# EAGLE schematic Arduhub_plane (EAGLE 7.3.0)

## Sheet 1 of 3: HUB
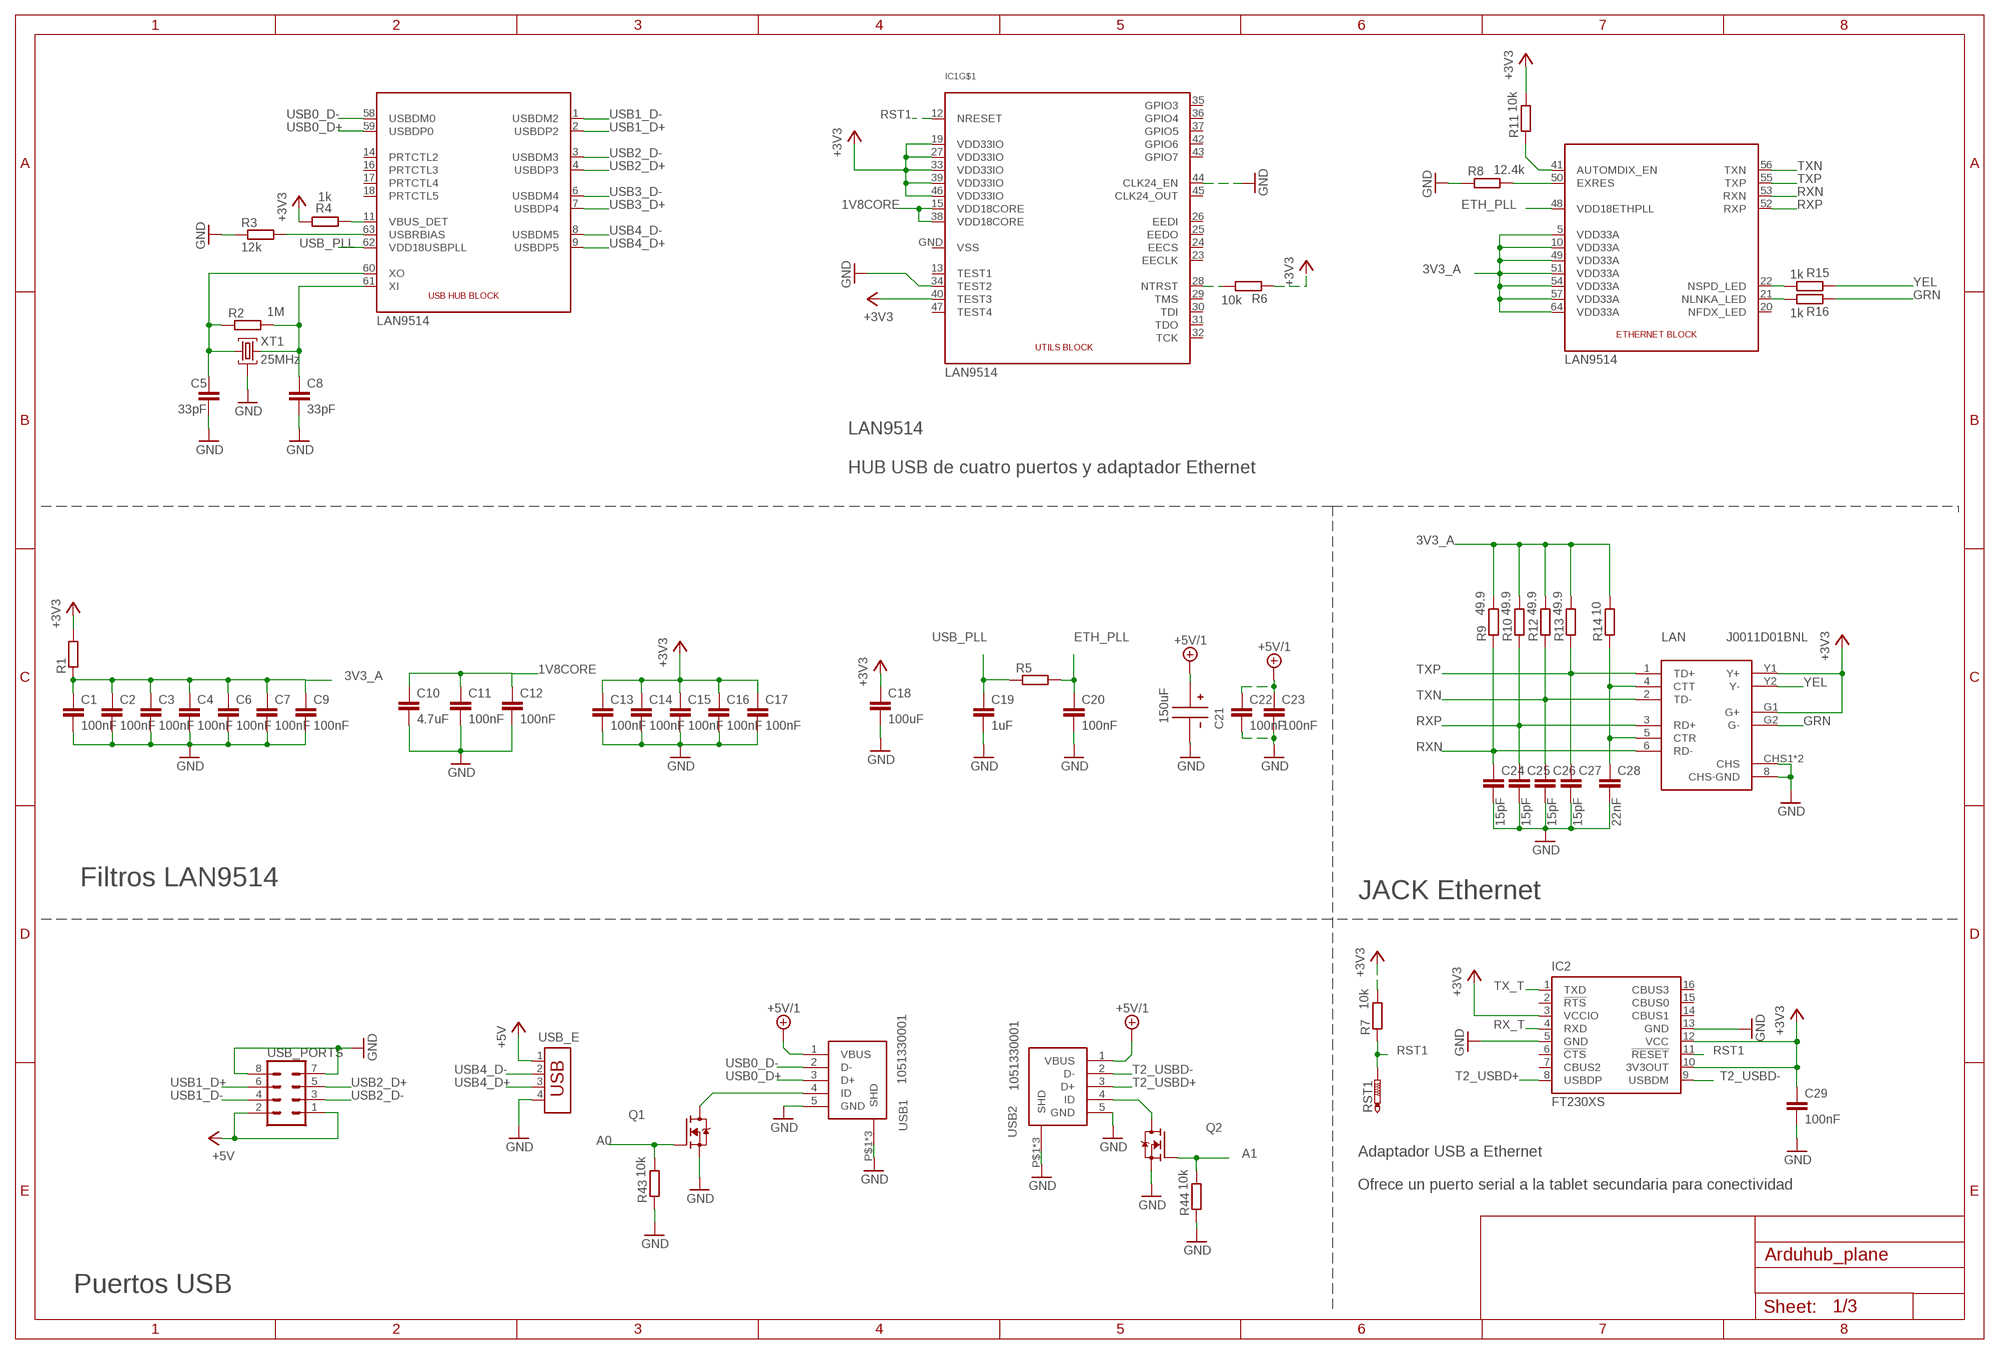
[diagram p0: schematic, sheet 1]

### Parts
C1  100nF  C-EUC0402  [C0402]
C2  100nF  C-EUC0402  [C0402]
C3  100nF  C-EUC0402  [C0402]
C4  100nF  C-EUC0402  [C0402]
C5  33pF  C-EUC0402  [C0402]
C6  100nF  C-EUC0402  [C0402]
C7  100nF  C-EUC0402  [C0402]
C8  33pF  C-EUC0402  [C0402]
C9  100nF  C-EUC0402  [C0402]
C10  4.7uF  C-EUC0402  [C0402]
C11  100nF  C-EUC0402  [C0402]
C12  100nF  C-EUC0402  [C0402]
C13  100nF  C-EUC0402  [C0402]
C14  100nF  C-EUC0402  [C0402]
C15  100nF  C-EUC0402  [C0402]
C16  100nF  C-EUC0402  [C0402]
C17  100nF  C-EUC0402  [C0402]
C18  100uF  C-EUC0603  [C0603]
C19  1uF  C-EUC0402  [C0402]
C20  100nF  C-EUC0402  [C0402]
C21  150uF  EMVE100ADA151MF55G  [MVA_CAP_F55]
C22  100nF  C-EUC0402  [C0402]
C23  100nF  C-EUC0402  [C0402]
C24  15pF  C-EUC0402  [C0402]
C25  15pF  C-EUC0402  [C0402]
C26  15pF  C-EUC0402  [C0402]
C27  15pF  C-EUC0402  [C0402]
C28  22nF  C-EUC0402  [C0402]
C29  100nF  C-EUC0402  [C0402]
IC1  LAN9514  [QFN64]
IC2  FT230XS  [SSOP16]
LAN  J0011D01BNL  [J0011D01BNL]
Q1  TRANSISTOR_FET_BS170-SOT-23  [SOT-23]
Q2  TRANSISTOR_FET_BS170-SOT-23  [SOT-23]
R1  R-EU_R0603  [R0603]
R2  1M  R-EU_R0402  [R0402]
R3  12k  R-EU_R0402  [R0402]
R4  1k  R-EU_R0402  [R0402]
R5  R-EU_R0603  [R0603]
R6  10k  R-EU_R0402  [R0402]
R7  10k  R-EU_R0402  [R0402]
R8  12.4k  R-EU_R0402  [R0402]
R9  49.9  R-EU_R0402  [R0402]
R10  49.9  R-EU_R0402  [R0402]
R11  10k  R-EU_R0402  [R0402]
R12  49.9  R-EU_R0402  [R0402]
R13  49.9  R-EU_R0402  [R0402]
R14  10  R-EU_R0402  [R0402]
R15  1k  R-EU_R0402  [R0402]
R16  1k  R-EU_R0402  [R0402]
R43  10k  R-EU_R0402  [R0402]
R44  10k  R-EU_R0402  [R0402]
RST1  PTR1B1,27  [B1,27]
USB1  1051330001  [1051330001]
USB2  1051330001  [1051330001]
USB_E  USB-787616  [USB]
USB_PORTS  MA04-2  [MA04-2]
XT1  25MHz  ABM8G  [ABM8G]

### Nets
1V8CORE: C10.1 C11.1 C12.1 IC1.15(VDD18CORE) IC1.38(VDD18CORE)
3V3_A: C1.1 C2.1 C3.1 C4.1 C6.1 C7.1 C9.1 IC1.5(VDD33A) IC1.10(VDD33A) IC1.49(VDD33A) IC1.51(VDD33A) IC1.54(VDD33A) IC1.57(VDD33A) IC1.64(VDD33A) R1.1 R9.2 R10.2 R12.2 R13.2 R14.2
+3V3: C13.1 C14.1 C15.1 C16.1 C17.1 C18.1 C29.1 IC1.19(VDD33IO) IC1.27(VDD33IO) IC1.33(VDD33IO) IC1.39(VDD33IO) IC1.40(TEST3) IC1.46(VDD33IO) IC2.3(VCCIO) IC2.10(3V3OUT) IC2.12(VCC) LAN.G1(G+) LAN.Y1(Y+) R1.2 R4.2 R6.1 R7.2 R11.2 ; also sheet 2
+5V: USB_E.1 USB_PORTS.1 USB_PORTS.2 ; also sheet 2
+5V/1: C21.P$+ C22.1 C23.1 USB1.1(VBUS) USB2.1(VBUS) ; also sheet 2
A0: Q1.1(G) R43.2 ; also sheet 2
A1: Q2.1(G) R44.2 ; also sheet 2
ETH_PLL: C20.1 IC1.48(VDD18ETHPLL) R5.2
GND: C1.2 C2.2 C3.2 C4.2 C5.2 C6.2 C7.2 C8.2 C9.2 C10.2 C11.2 C12.2 C13.2 C14.2 C15.2 C16.2 C17.2 C18.2 C19.2 C20.2 C21.P$- C22.2 C23.2 C24.2 C25.2 C26.2 C27.2 C28.2 C29.2 IC1.34(TEST2) IC1.44(CLK24_EN) IC2.5(GND) IC2.13(GND) LAN.8(CHS-GND) LAN.CHS1(CHS) LAN.CHS2(CHS) Q1.2(S) Q2.2(S) R3.1 R8.1 R43.1 R44.1 USB1.5(GND) USB1.P$1(SHD) USB1.P$2(SHD) USB1.P$3(SHD) USB2.5(GND) USB2.P$1(SHD) USB2.P$2(SHD) USB2.P$3(SHD) USB_E.4 USB_PORTS.7 USB_PORTS.8 XT1.2 XT1.4 ; also sheet 2
GRN: LAN.G2(G-) R16.1
N$1: C5.1 IC1.60(XO) R2.1 XT1.1
N$2: C8.1 IC1.61(XI) R2.2 XT1.3
N$3: IC1.50(EXRES) R8.2
N$4: IC1.63(USBRBIAS) R3.2
N$5: C28.1 LAN.4(CTT) LAN.5(CTR) R14.1
N$6: IC1.41(AUTOMDIX_EN) R11.1
N$7: IC1.21(NLNKA_LED) R16.2
N$8: IC1.22(NSPD_LED) R15.2
N$9: Q1.3(D) USB1.4(ID)
N$10: IC1.28(NTRST) R6.2
N$21: Q2.3(D) USB2.4(ID)
N$33: IC1.11(VBUS_DET) R4.1
RST1: IC1.12(NRESET) IC2.11(!RESET) R7.1 RST1.TP ; also sheet 2
RX_T: IC2.4(RXD) ; also sheet 2
RXN: C24.1 IC1.53(RXN) LAN.6(RD-) R9.1
RXP: C25.1 IC1.52(RXP) LAN.3(RD+) R10.1
T2_USBD+: IC2.8(USBDP) USB2.3(D+)
T2_USBD-: IC2.9(USBDM) USB2.2(D-)
TX_T: IC2.1(TXD) ; also sheet 2
TXN: C26.1 IC1.56(TXN) LAN.2(TD-) R12.1
TXP: C27.1 IC1.55(TXP) LAN.1(TD+) R13.1
USB0_D+: IC1.59(USBDP0) USB1.3(D+)
USB0_D-: IC1.58(USBDM0) USB1.2(D-)
USB1_D+: IC1.2(USBDP2) USB_PORTS.6
USB1_D-: IC1.1(USBDM2) USB_PORTS.4
USB2_D+: IC1.4(USBDP3) USB_PORTS.5
USB2_D-: IC1.3(USBDM3) USB_PORTS.3
USB3_D+: IC1.7(USBDP4) ; also sheet 2
USB3_D-: IC1.6(USBDM4) ; also sheet 2
USB4_D+: IC1.9(USBDP5) USB_E.3
USB4_D-: IC1.8(USBDM5) USB_E.2
USB_PLL: C19.1 IC1.62(VDD18USBPLL) R5.1
YEL: LAN.Y2(Y-) R15.1
Unconnected: IC1.13(TEST1) IC1.14(PRTCTL2) IC1.16(PRTCTL3) IC1.17(PRTCTL4) IC1.18(PRTCTL5) IC1.20(NFDX_LED) IC1.23(EECLK) IC1.24(EECS) IC1.25(EEDO) IC1.26(EEDI) IC1.29(TMS) IC1.30(TDI) IC1.31(TDO) IC1.32(TCK) IC1.35(GPIO3) IC1.36(GPIO4) IC1.37(GPIO5) IC1.42(GPIO6) IC1.43(GPIO7) IC1.45(CLK24_OUT) IC1.47(TEST4) IC1.GND(VSS) IC2.2(!RTS) IC2.6(!CTS) IC2.7(CBUS2) IC2.14(CBUS1) IC2.15(CBUS0) IC2.16(CBUS3)

### Notes on the sheet
- LAN9514
  
  HUB USB de cuatro puertos y adaptador Ethernet
- Filtros LAN9514
- JACK Ethernet
- Adaptador USB a Ethernet
  
  Ofrece un puerto serial a la tablet secundaria para conectividad
- Puertos USB

## Sheet 2 of 3: UART, uC, Energía
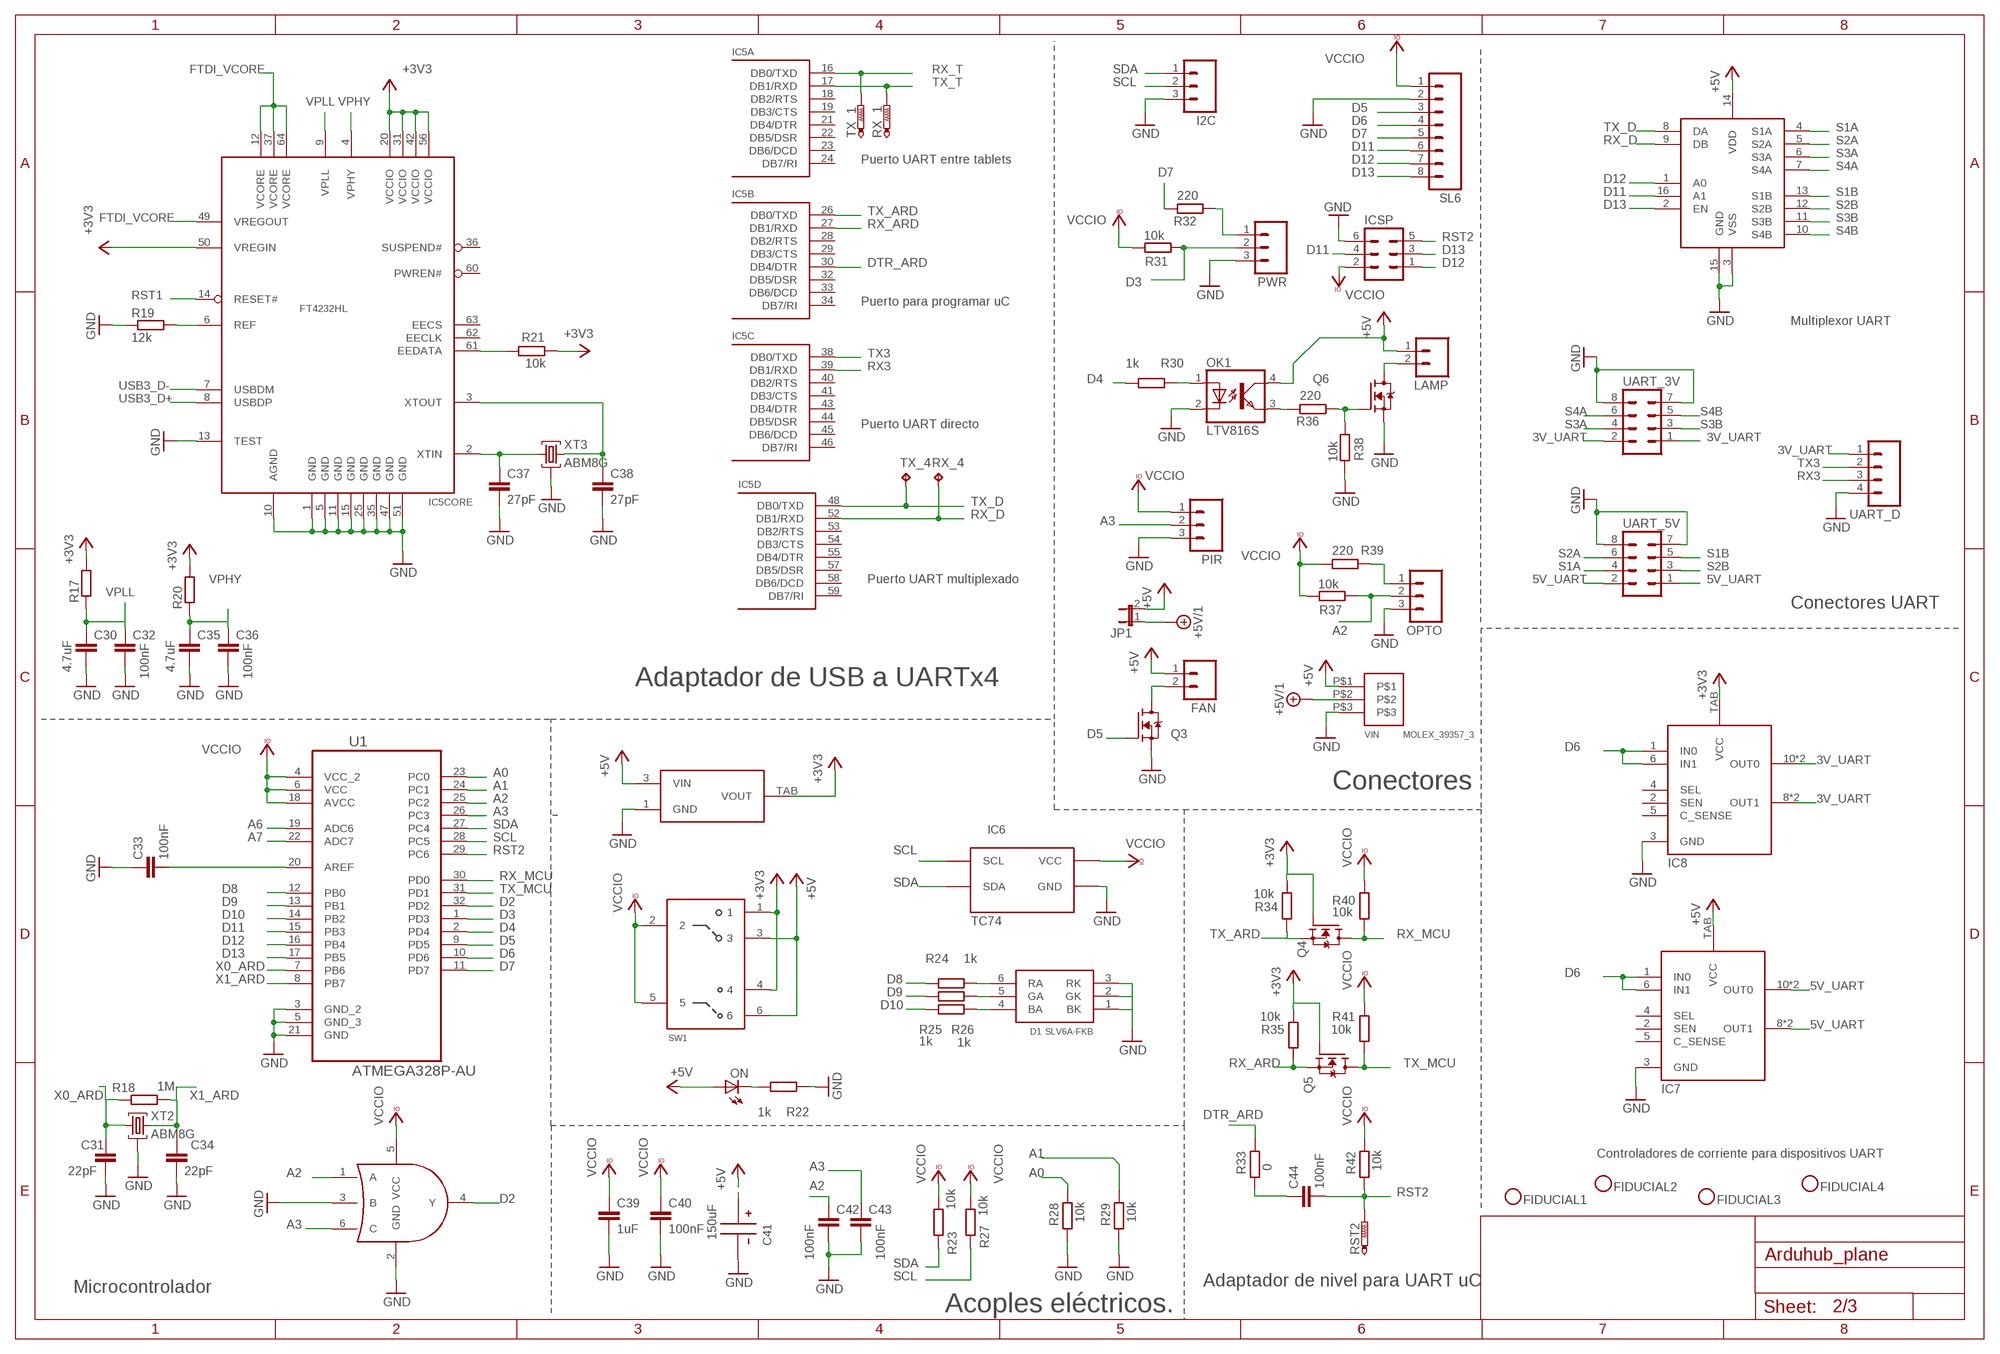
[diagram p1: schematic, sheet 2]

### Parts
C30  4.7uF  C-EUC0402  [C0402]
C31  22pF  C-EUC0402  [C0402]
C32  100nF  C-EUC0402  [C0402]
C33  100nF  C-EUC0402  [C0402]
C34  22pF  C-EUC0402  [C0402]
C35  4.7uF  C-EUC0402  [C0402]
C36  100nF  C-EUC0402  [C0402]
C37  27pF  C-EUC0402  [C0402]
C38  27pF  C-EUC0402  [C0402]
C39  1uF  C-EUC0402  [C0402]
C40  100nF  C-EUC0402  [C0402]
C41  150uF  EMVE100ADA151MF55G  [MVA_CAP_F55]
C42  100nF  C-EUC0402  [C0402]
C43  100nF  C-EUC0402  [C0402]
C44  100nF  C-EUC0402  [C0402]
D1  SLV6A-FKB  [PLCC-6]
FAN  M02  [02P]
FIDUCIAL1  FIDU_2C  [FIDUCIAL_TEST_2C]
FIDUCIAL2  FIDU_2C  [FIDUCIAL_TEST_2C]
FIDUCIAL3  FIDU_2C  [FIDUCIAL_TEST_2C]
FIDUCIAL4  FIDU_2C  [FIDUCIAL_TEST_2C]
I2C  M03  [03P]
IC3  SN74LVC1G332DBVR  [SOT-23-6]
IC4  AP1084D  [TO_252_3]
IC5  FT4232HL  [LQFP64]
IC6  TC74  [SOT-23-5]
IC7  VND7140AJ12TR  [POWERSSO-12]
IC8  VND7140AJ12TR  [POWERSSO-12]
IC9  MUX509IPWR  [TSSOP-16]
ICSP  MA03-2  [MA03-2]
JP1  JP1E  [JP1]
LAMP  M02  [02P]
OK1  LTV816S  [SMD4]
ON  LED-0603  [LED-603]
OPTO  M03  [03P]
PIR  M03  [03P]
PWR  M03  [03P]
Q3  TRANSISTOR_FET_BS170-SOT-23  [SOT-23]
Q4  TRANSISTOR_FET_BS170-SOT-23  [SOT-23]
Q5  TRANSISTOR_FET_BS170-SOT-23  [SOT-23]
Q6  TRANSISTOR_FET_BS170-SOT-23  [SOT-23]
R17  R-EU_R0603  [R0603]
R18  1M  R-EU_R0402  [R0402]
R19  12k  R-EU_R0402  [R0402]
R20  R-EU_R0603  [R0603]
R21  10k  R-EU_R0402  [R0402]
R22  1k  R-EU_R0402  [R0402]
R23  10k  R-EU_R0402  [R0402]
R24  1k  R-EU_R0402  [R0402]
R25  1k  R-EU_R0402  [R0402]
R26  1k  R-EU_R0402  [R0402]
R27  10k  R-EU_R0402  [R0402]
R28  10k  R-EU_R0402  [R0402]
R29  10k  R-EU_R0402  [R0402]
R30  1k  R-EU_R0402  [R0402]
R31  10k  R-EU_R0402  [R0402]
R32  220  R-EU_R0402  [R0402]
R33  0  R-EU_R0402  [R0402]
R34  10k  R-EU_R0402  [R0402]
R35  10k  R-EU_R0402  [R0402]
R36  220  R-EU_R0402  [R0402]
R37  10k  R-EU_R0402  [R0402]
R38  10k  R-EU_R0402  [R0402]
R39  220  R-EU_R0402  [R0402]
R40  10k  R-EU_R0402  [R0402]
R41  10k  R-EU_R0402  [R0402]
R42  10k  R-EU_R0402  [R0402]
RST2  PTR1TP06SQ  [TP06SQ]
RX_1  PTR1TP06SQ  [TP06SQ]
RX_4  TPTP06SQ  [TP06SQ]
SL6  M08  [08P]
SW1  452403012014  [452403012014]
TX_1  PTR1TP06SQ  [TP06SQ]
TX_4  TPTP06SQ  [TP06SQ]
U1  ATMEGA328P-AU  [QFP80P900X900X120-32N]
UART_3V  MA04-2  [MA04-2]
UART_5V  MA04-2  [MA04-2]
UART_D  M04  [04P]
VIN  MOLEX_39357_3  [MOLEX_39357-3]
XT2  ABM8G  [ABM8G]
XT3  ABM8G  [ABM8G]

### Nets
3V_UART: IC8.8(OUT1) IC8.9(OUT1) IC8.10(OUT0) IC8.11(OUT0) UART_3V.1 UART_3V.2 UART_D.1
5V_UART: IC7.8(OUT1) IC7.9(OUT1) IC7.10(OUT0) IC7.11(OUT0) UART_5V.1 UART_5V.2
+3V3: IC4.TAB(VOUT) IC5.20(CORE:VCCIO) IC5.31(CORE:VCCIO) IC5.42(CORE:VCCIO) IC5.50(CORE:VREGIN) IC5.56(CORE:VCCIO) IC8.TAB(VCC) Q4.1(G) Q5.1(G) R17.2 R20.2 R21.1 R34.1 R35.1 SW1.1 SW1.4 ; also sheet 1
+5V: C41.P$+ FAN.1 IC4.3(VIN) IC7.TAB(VCC) IC9.14(VDD) JP1.2 LAMP.1 OK1.4(COL) ON.A SW1.3 SW1.6 VIN.P$1 ; also sheet 1
+5V/1: JP1.1 VIN.P$2 ; also sheet 1
A0: R28.1 U1.23(PC0) ; also sheet 1
A1: R29.1 U1.24(PC1) ; also sheet 1
A2: C42.1 IC3.1(A) OPTO.2 R37.2 U1.25(PC2)
A3: C43.1 IC3.6(C) PIR.2 U1.26(PC3)
A6: U1.19(ADC6)
A7: U1.22(ADC7)
D2: IC3.4(Y) U1.32(PD2)
D3: PWR.2 R31.2 U1.1(PD3)
D4: R30.2 U1.2(PD4)
D5: Q3.1(G) SL6.3 U1.9(PD5)
D6: IC7.1(IN0) IC7.6(IN1) IC8.1(IN0) IC8.6(IN1) SL6.4 U1.10(PD6)
D7: R32.2 SL6.5 U1.11(PD7)
D8: R24.1 U1.12(PB0)
D9: R25.1 U1.13(PB1)
D10: R26.1 U1.14(PB2)
D11: IC9.16(A1) ICSP.4 SL6.6 U1.15(PB3)
D12: IC9.1(A0) ICSP.1 SL6.7 U1.16(PB4)
D13: IC9.2(EN) ICSP.3 SL6.8 U1.17(PB5)
DTR_ARD: IC5.30(B:DB4/DTR) R33.1
FTDI_VCORE: IC5.12(CORE:VCORE) IC5.37(CORE:VCORE) IC5.49(CORE:VREGOUT) IC5.64(CORE:VCORE)
GND: C30.2 C31.2 C32.2 C33.1 C34.2 C35.2 C36.2 C37.2 C38.2 C39.2 C40.2 C41.P$- C42.2 C43.2 D1.1(BK) D1.2(GK) D1.3(RK) I2C.3 IC3.2(GND) IC3.3(B) IC4.1(GND) IC5.1(CORE:GND) IC5.5(CORE:GND) IC5.10(CORE:AGND) IC5.11(CORE:GND) IC5.13(CORE:TEST) IC5.15(CORE:GND) IC5.25(CORE:GND) IC5.35(CORE:GND) IC5.47(CORE:GND) IC5.51(CORE:GND) IC6.2(GND) IC7.3(GND) IC8.3(GND) IC9.3(VSS) IC9.15(GND) ICSP.6 OK1.2(C) OPTO.3 PIR.3 PWR.3 Q3.2(S) Q6.2(S) R19.1 R22.1 R28.2 R29.2 R38.1 SL6.2 U1.3(GND_2) U1.5(GND_3) U1.21(GND) UART_3V.7 UART_3V.8 UART_5V.7 UART_5V.8 UART_D.4 VIN.P$3 XT2.2 XT2.4 XT3.2 XT3.4 ; also sheet 1
N$11: IC5.61(CORE:EEDATA) R21.2
N$12: IC5.6(CORE:REF) R19.2
N$13: C37.1 IC5.2(CORE:XTIN) XT3.1
N$14: C38.1 IC5.3(CORE:XTOUT) XT3.3
N$17: C33.2 U1.20(AREF)
N$18: D1.6(RA) R24.2
N$19: D1.5(GA) R25.2
N$20: D1.4(BA) R26.2
N$23: ON.C R22.2
N$24: LAMP.2 Q6.3(D)
N$25: OPTO.1 R39.1
N$26: Q6.1(G) R36.1 R38.2
N$27: OK1.3(EMIT) R36.2
N$28: OK1.1(A) R30.1
N$29: FAN.2 Q3.3(D)
N$30: PWR.1 R32.1
N$32: C44.1 R33.2
RST1: IC5.14(CORE:RESET#) ; also sheet 1
RST2: C44.2 ICSP.5 R42.2 RST2.TP U1.29(PC6)
RX3: IC5.39(C:DB1/RXD) UART_D.3
RX_ARD: IC5.27(B:DB1/RXD) Q5.2(S) R35.2
RX_D: IC5.52(D:DB1/RXD) IC9.9(DB) RX_4.TP
RX_MCU: Q4.3(D) R40.2 U1.30(PD0)
RX_T: IC5.16(A:DB0/TXD) TX_1.TP ; also sheet 1
S1A: IC9.4(S1A) UART_5V.4
S1B: IC9.13(S1B) UART_5V.5
S2A: IC9.5(S2A) UART_5V.6
S2B: IC9.12(S2B) UART_5V.3
S3A: IC9.6(S3A) UART_3V.4
S3B: IC9.11(S3B) UART_3V.3
S4A: IC9.7(S4A) UART_3V.6
S4B: IC9.10(S4B) UART_3V.5
SCL: I2C.2 IC6.4(SCL) R27.2 U1.28(PC5)
SDA: I2C.1 IC6.5(SDA) R23.2 U1.27(PC4)
TX3: IC5.38(C:DB0/TXD) UART_D.2
TX_ARD: IC5.26(B:DB0/TXD) Q4.2(S) R34.2
TX_D: IC5.48(D:DB0/TXD) IC9.8(DA) TX_4.TP
TX_MCU: Q5.3(D) R41.2 U1.31(PD1)
TX_T: IC5.17(A:DB1/RXD) RX_1.TP ; also sheet 1
USB3_D+: IC5.8(CORE:USBDP) ; also sheet 1
USB3_D-: IC5.7(CORE:USBDM) ; also sheet 1
VCCIO: C39.1 C40.1 IC3.5(VCC) IC6.3(VCC) ICSP.2 PIR.1 R23.1 R27.1 R31.1 R37.1 R39.2 R40.1 R41.1 R42.1 SL6.1 SW1.2 SW1.5 U1.4(VCC_2) U1.6(VCC) U1.18(AVCC)
VPHY: C35.1 C36.1 IC5.4(CORE:VPHY) R20.1
VPLL: C30.1 C32.1 IC5.9(CORE:VPLL) R17.1
X0_ARD: C31.1 R18.1 U1.7(PB6) XT2.1
X1_ARD: C34.1 R18.2 U1.8(PB7) XT2.3
Unconnected: IC5.18(A:DB2/RTS) IC5.19(A:DB3/CTS) IC5.21(A:DB4/DTR) IC5.22(A:DB5/DSR) IC5.23(A:DB6/DCD) IC5.24(A:DB7/RI) IC5.28(B:DB2/RTS) IC5.29(B:DB3/CTS) IC5.32(B:DB5/DSR) IC5.33(B:DB6/DCD) IC5.34(B:DB7/RI) IC5.36(CORE:SUSPEND#) IC5.40(C:DB2/RTS) IC5.41(C:DB3/CTS) IC5.43(C:DB4/DTR) IC5.44(C:DB5/DSR) IC5.45(C:DB6/DCD) IC5.46(C:DB7/RI) IC5.53(D:DB2/RTS) IC5.54(D:DB3/CTS) IC5.55(D:DB4/DTR) IC5.57(D:DB5/DSR) IC5.58(D:DB6/DCD) IC5.59(D:DB7/RI) IC5.60(CORE:PWREN#) IC5.62(CORE:EECLK) IC5.63(CORE:EECS) IC7.2(SEN) IC7.4(SEL) IC7.5(C_SENSE) IC8.2(SEN) IC8.4(SEL) IC8.5(C_SENSE)

### Notes on the sheet
- Puerto UART entre tablets
- Puerto para programar uC
- Multiplexor UART
- Puerto UART directo
- Puerto UART multiplexado
- Conectores UART
- Adaptador de USB a UARTx4
- Conectores
- Controladores de corriente para dispositivos UART
- Adaptador de nivel para UART uC
- Microcontrolador
- Acoples eléctricos.

## Sheet 3 of 3: Adicionales
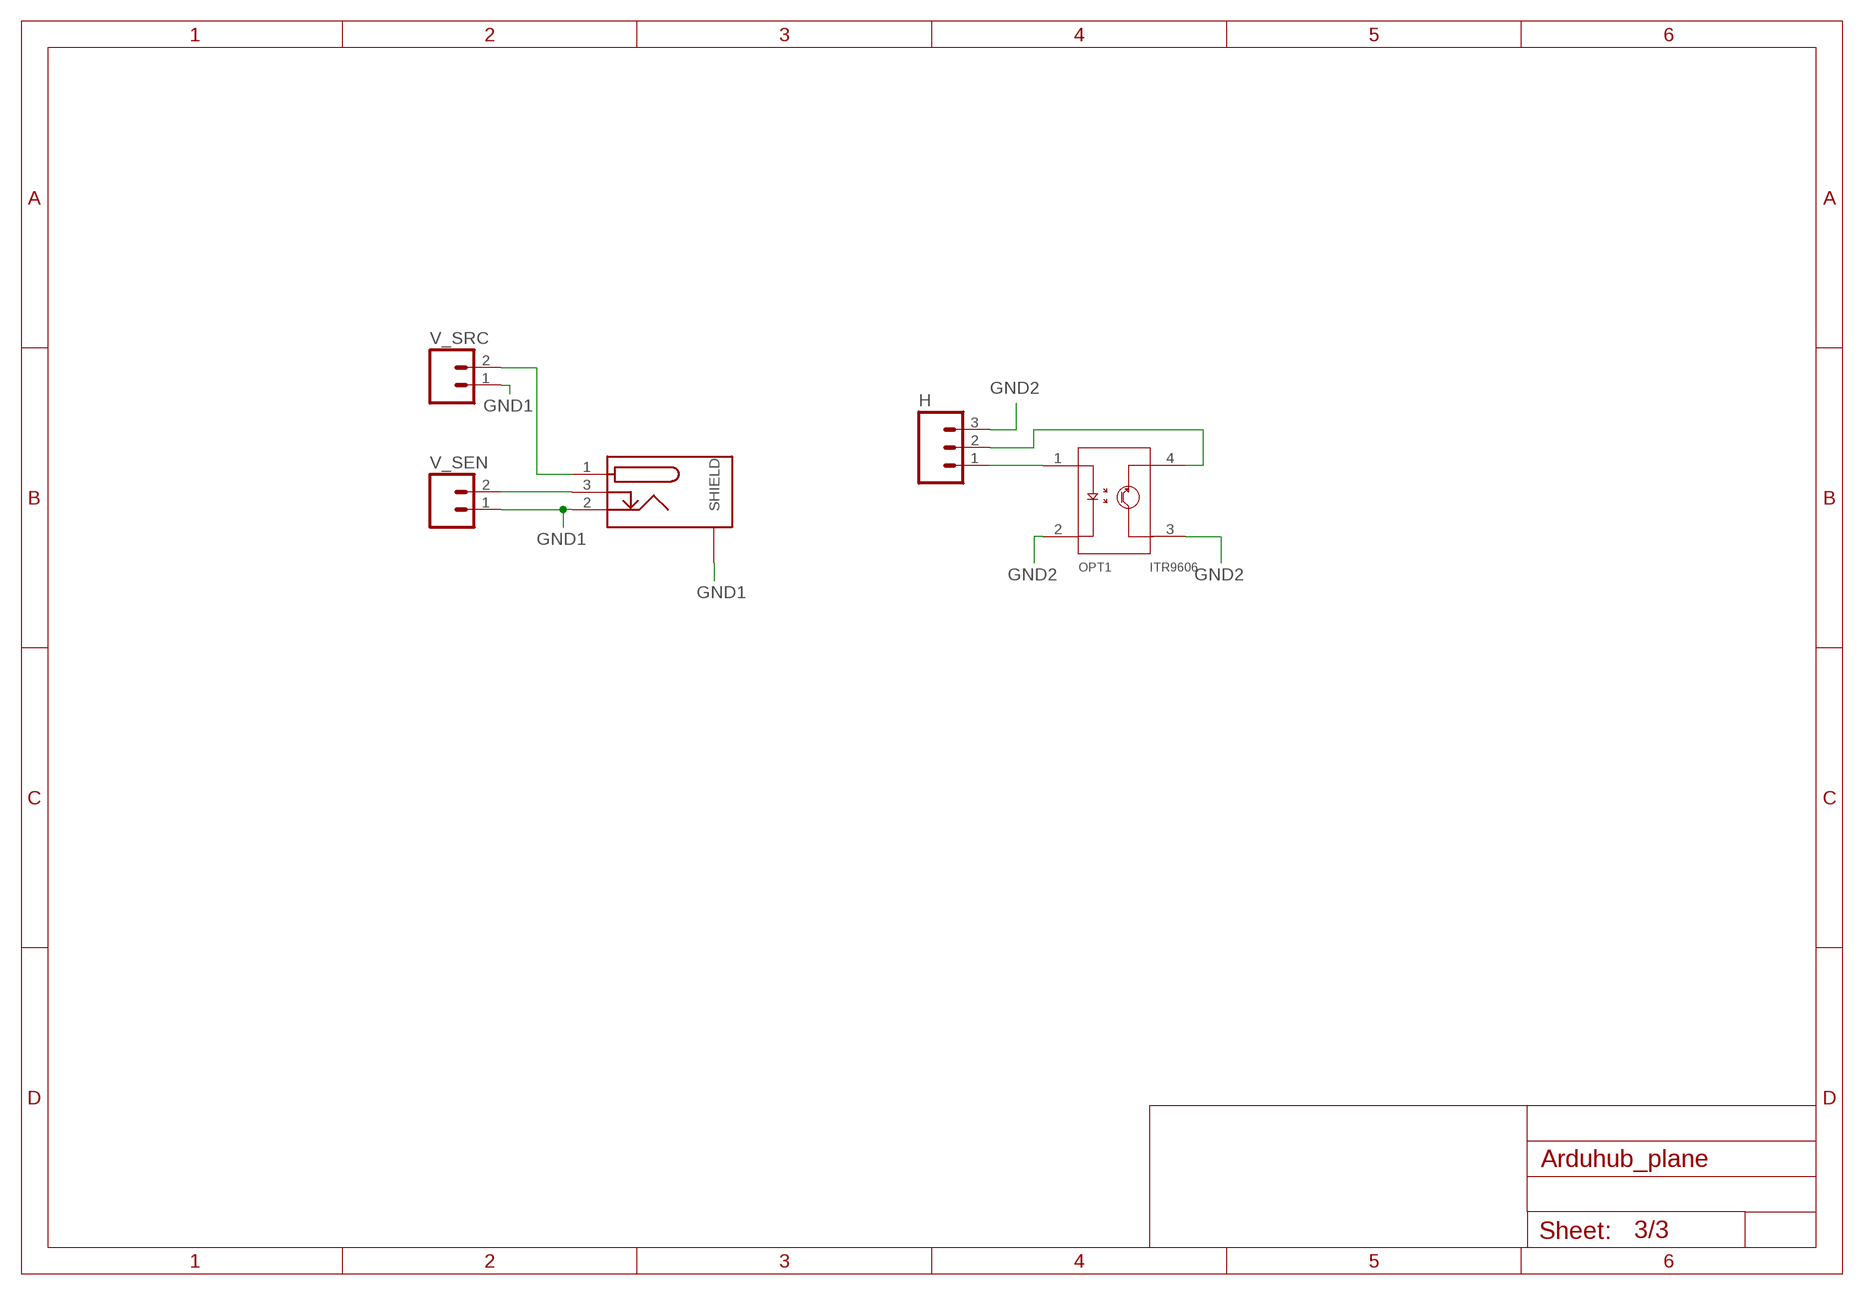
[diagram p2: schematic, sheet 3]

### Parts
H  M03  [03P]
OPT1  ITR9606  [ITR9606]
PLUG  PJ051A  [PJ051A]
V_SEN  M02  [02P]
V_SRC  M02  [02P]

### Nets
GND1: PLUG.2 PLUG.P$1(SHIELD) PLUG.P$2(SHIELD) V_SEN.1 V_SRC.1
GND2: H.3 OPT1.2 OPT1.3
N$15: H.1 OPT1.1
N$16: H.2 OPT1.4
N$22: PLUG.3 V_SEN.2
N$31: PLUG.1 V_SRC.2

## Library data of the parts
C1-C4 C6 C7 C9 C11-C17 C20 C22 C23 C29 C32 C33 C36 C40 C42-C44 = rcl:C-EU: CAPACITOR, European symbol; REF: GRM155R71C104KA88D
C5 C8 = rcl:C-EU: CAPACITOR, European symbol; REF: GRM1555C1H330FA01D
C10 C30 C35 = rcl:C-EU: CAPACITOR, European symbol; REF: GRM155R60J475ME87D
C18 = rcl:C-EU: CAPACITOR, European symbol; REF: F980J107MMAAXE
C19 C39 = rcl:C-EU: CAPACITOR, European symbol; REF: GRM155C80J105KE15D
C21 C41 = PrismLibs:EMVE100ADA: United Chemi-con SMD Aluminium capacitor; REF: EMVA100ADA151MF55G
C24-C27 = rcl:C-EU: CAPACITOR, European symbol; REF: GRM1555C1H150FA01D
C28 = rcl:C-EU: CAPACITOR, European symbol; REF: GRM155R71E223JA61D
C31 C34 = rcl:C-EU: CAPACITOR, European symbol; REF: GRM1555C1H220FA01D
C37 C38 = rcl:C-EU: CAPACITOR, European symbol; REF: GRM1555C1H270FA01D
D1 = PrismLibs:SLV6A-FKB: CREE PLCC6 RGB Led; REF: SLV6A-FKB-CK1P1G1BB7R3R3
FAN LAMP V_SEN V_SRC = con-amp-quick:M02: AMP QUICK CONNECTOR; OC_FARNELL: unknown; OC_NEWARK: unknown; REF: 22-28-4023
FIDUCIAL1-FIDUCIAL4 = Fiduciales_test_Eagle:FIDU_2C
H I2C OPTO PIR PWR = con-amp-quick:M03: AMP QUICK CONNECTOR; OC_FARNELL: unknown; OC_NEWARK: unknown; REF: 22-28-4033
IC1 = PrismLibs:LAN9514: USB Bridge to USBx4 and Ethernet QFN64; REF: LAN9514-JZX-TR
IC2 = ftdichip:FT230X: USB to BASIC UART IC Auto generated by make-symbol-device-package-bsdl.ulp Rev. 43 Source: Data sheet <http://www.ftdichip.com/Support/Documents/DataSheets/ICs/DS_FT230X.pdf>; REF: FT230XS-U
IC3 = PrismLibs:SN74LVC1G332DBVR; REF: SN74LVC1G332DBVR
IC4 = PrismLibs:AP1084D; REF: AZ1084CD-3.3TRG1
IC5 = ftdichip-4:FT4232H: Quad USB UART 5th generation USB to 4-port serial controller; REF: FT4232HL-REEL
IC6 = PrismLibs:TC74: I2C Temperature Sensor; REF: TC74A0-5.0VCTTR
IC7 IC8 = PrismLibs:VND7140AJ12TR; REF: VND7140AJ12TR
IC9 = PrismLibs:MUX509IPWR; REF: MUX509IPWR
ICSP = con-lstb:MA03-2: PIN HEADER; OC_FARNELL: unknown; OC_NEWARK: unknown; REF: 5-146256-3
JP1 = jumper:JP1E: JUMPER; REF: 22-28-4023
LAN = PrismLibs:J0011D01BNL; REF: J0011D01BNL
OK1 = optocoupler:LTV816: OPTO COUPLER Source: LITEON, LTV816.pdf; OC_FARNELL: unknown; OC_NEWARK: unknown; REF: LTV-816S-TA1
ON = dp_devices:LED: Light Emitting Diode; REF: SML-D12M8WT86
OPT1 = PrismLibs:ITR9606; REF: GP1S53VJ000F
PLUG = PrismLibs:PJ051A; REF: PJ-051AH
Q1-Q3 = dp_devices:TRANSISTOR_FET_BS170: N-Channel Enhancement Mode Field Effect Transistor; REF: BS170FTA
Q4 Q5 = dp_devices:TRANSISTOR_FET_BS170: N-Channel Enhancement Mode Field Effect Transistor; REF: BSS138
Q6 = dp_devices:TRANSISTOR_FET_BS170: N-Channel Enhancement Mode Field Effect Transistor; REF: IRLML6344TRPBF
R1 R5 R17 R20 = rcl:R-EU_: RESISTOR, European symbol; REF: BLM18AG601SN1D
R2 R18 = rcl:R-EU_: RESISTOR, European symbol; REF: ERJ-2RKF1004X
R3 R19 = rcl:R-EU_: RESISTOR, European symbol; REF: ERJ-2RKF1202X
R4 R15 R16 R22 R24-R26 R30 = rcl:R-EU_: RESISTOR, European symbol; REF: ERJ-2RKF1001X
R6 R7 R11 R21 R23 R27-R29 R31 R34 R35 R37 R38 R40-R44 = rcl:R-EU_: RESISTOR, European symbol; REF: ERJ-2RKF1002X
R8 = rcl:R-EU_: RESISTOR, European symbol; REF: ERJ-2RKF1242X
R9 R10 R12 R13 = rcl:R-EU_: RESISTOR, European symbol; REF: ERJ-2RKF49R9X
R14 = rcl:R-EU_: RESISTOR, European symbol; REF: ERJ-2RKF10R0X
R32 R36 R39 = rcl:R-EU_: RESISTOR, European symbol; REF: ERJ-2RKF2200X
R33 = rcl:R-EU_: RESISTOR, European symbol
RST1 RST2 RX_1 TX_1 = testpad:PTR1: TEST PIN
RX_4 TX_4 = testpad:TP: Test pad
SL6 = con-amp-quick:M08: AMP QUICK CONNECTOR; OC_FARNELL: unknown; OC_NEWARK: unknown; REF: 22-28-8083
SW1 = PrismLibs:452403012014; REF: 452403012014
U1 = Atmel_By_element14_Batch_1-00:ATMEGA328P-AU: 8-bit Microcontroller with In-System Programmable Flash; MPN: ATMEGA328P-AU; OC_FARNELL: 1715486; OC_NEWARK: 14R4631; PACKAGE: TQFP-32; REF: ATMEGA328P-AU; SUPPLIER: Atmel
UART_3V UART_5V USB_PORTS = con-lstb:MA04-2: PIN HEADER; OC_FARNELL: unknown; OC_NEWARK: unknown; REF: 5-146256-4
UART_D = con-amp-quick:M04: AMP QUICK CONNECTOR; OC_FARNELL: unknown; OC_NEWARK: unknown; REF: 22-28-5044
USB1 USB2 = PrismLibs:1051330001; REF: 105133-0001
USB_E = con-amp:USB-787616: AMP connector; REF: 292303-1
VIN = PrismLibs:MOLEX_39357: Molex 3.5MM Eurostyle connector; REF: 39357-0003
XT1 = PrismLibs:ABM8G: Abracon ABM8G Crystal; REF: ABM8G-25.000MHZ-18-D2Y-T
XT2 = PrismLibs:ABM8G: Abracon ABM8G Crystal; REF: ABM8G-16.000MHZ-18-D2Y-T3
XT3 = PrismLibs:ABM8G: Abracon ABM8G Crystal; REF: ABM8G-12.000MHZ-18-D2Y-T